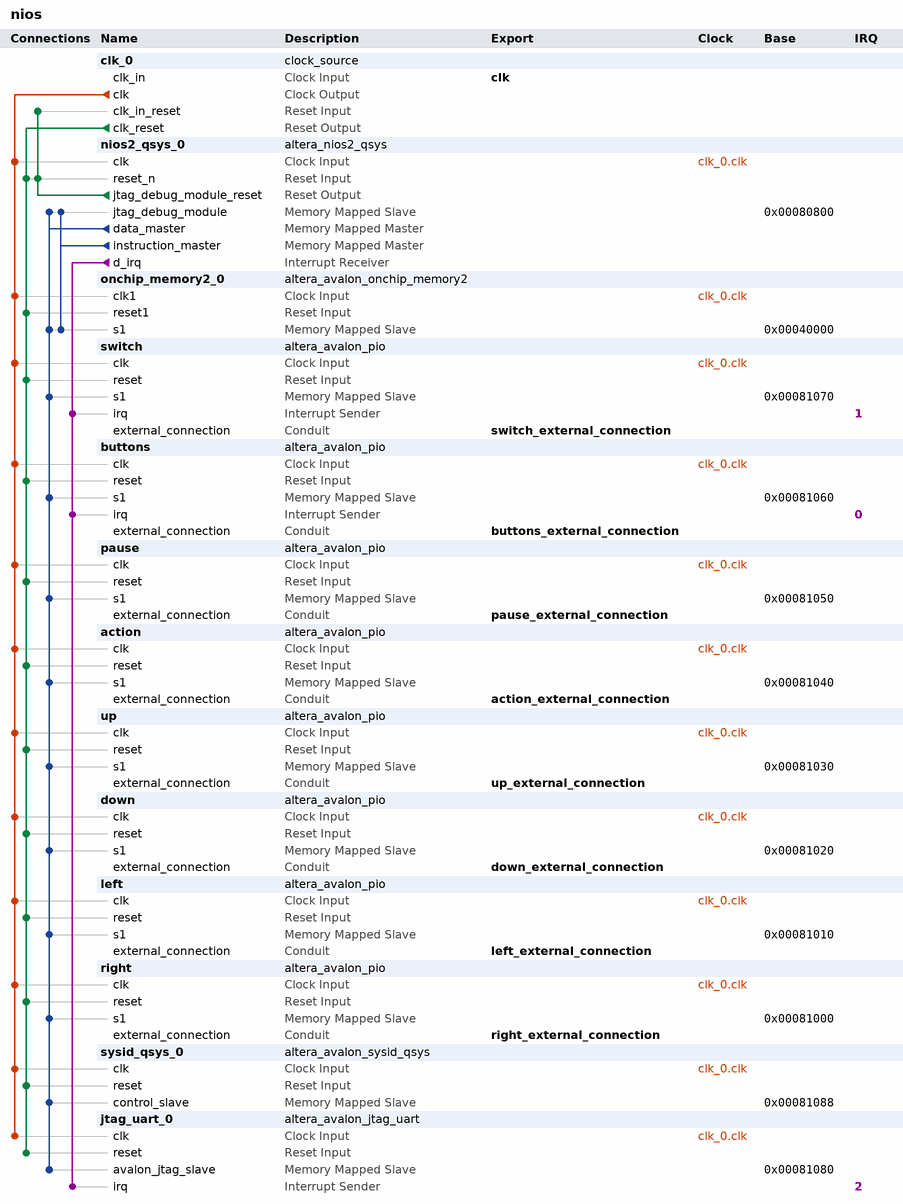
[diagram p0: system contents]
# Platform Designer (Qsys) system nios, Cyclone V 5CGXFC5C6F27C7
# Parameters at their usual value, and those the tool derives, are not listed.
package require -exact qsys 13.0.1
create_system nios
set_project_property DEVICE_FAMILY {Cyclone V}
set_project_property DEVICE 5CGXFC5C6F27C7

add_instance clk_0 clock_source 13.0
set_instance_parameter_value clk_0 clockFrequency 50000000

add_instance nios2_qsys_0 altera_nios2_qsys 13.0
set_instance_parameter_value nios2_qsys_0 resetSlave onchip_memory2_0.s1
set_instance_parameter_value nios2_qsys_0 mmu_TLBMissExcSlave None
set_instance_parameter_value nios2_qsys_0 exceptionSlave onchip_memory2_0.s1
set_instance_parameter_value nios2_qsys_0 breakSlave nios2_qsys_0.jtag_debug_module
set_instance_parameter_value nios2_qsys_0 impl Fast
set_instance_parameter_value nios2_qsys_0 icache_size 4096

add_instance onchip_memory2_0 altera_avalon_onchip_memory2 13.0.1
set_instance_parameter_value onchip_memory2_0 dataWidth 32
set_instance_parameter_value onchip_memory2_0 dualPort false
set_instance_parameter_value onchip_memory2_0 initMemContent true
set_instance_parameter_value onchip_memory2_0 initializationFileName onchip_mem.hex
set_instance_parameter_value onchip_memory2_0 memorySize 262144

add_instance switch altera_avalon_pio 13.0.1
set_instance_parameter_value switch captureEdge true
set_instance_parameter_value switch direction Input
set_instance_parameter_value switch edgeType ANY
set_instance_parameter_value switch generateIRQ true
set_instance_parameter_value switch irqType EDGE
set_instance_parameter_value switch width 2

add_instance buttons altera_avalon_pio 13.0.1
set_instance_parameter_value buttons captureEdge true
set_instance_parameter_value buttons direction Input
set_instance_parameter_value buttons edgeType ANY
set_instance_parameter_value buttons generateIRQ true
set_instance_parameter_value buttons irqType EDGE
set_instance_parameter_value buttons width 4

add_instance pause altera_avalon_pio 13.0.1
set_instance_parameter_value pause direction Output
set_instance_parameter_value pause width 1

add_instance action altera_avalon_pio 13.0.1
set_instance_parameter_value action direction Output
set_instance_parameter_value action width 1

add_instance up altera_avalon_pio 13.0.1
set_instance_parameter_value up direction Output
set_instance_parameter_value up width 1

add_instance down altera_avalon_pio 13.0.1
set_instance_parameter_value down direction Output
set_instance_parameter_value down width 1

add_instance left altera_avalon_pio 13.0.1
set_instance_parameter_value left direction Output
set_instance_parameter_value left width 1

add_instance right altera_avalon_pio 13.0.1
set_instance_parameter_value right direction Output
set_instance_parameter_value right width 1

add_instance sysid_qsys_0 altera_avalon_sysid_qsys 13.0
set_instance_parameter_value sysid_qsys_0 id 4919

add_instance jtag_uart_0 altera_avalon_jtag_uart 13.0.1
set_instance_parameter_value jtag_uart_0 simInteractiveOptions NO_INTERACTIVE_WINDOWS

# connections
add_connection clk_0.clk action.clk clock
add_connection clk_0.clk buttons.clk clock
add_connection clk_0.clk down.clk clock
add_connection clk_0.clk jtag_uart_0.clk clock
add_connection clk_0.clk left.clk clock
add_connection clk_0.clk nios2_qsys_0.clk clock
add_connection clk_0.clk onchip_memory2_0.clk1 clock
add_connection clk_0.clk pause.clk clock
add_connection clk_0.clk right.clk clock
add_connection clk_0.clk switch.clk clock
add_connection clk_0.clk sysid_qsys_0.clk clock
add_connection clk_0.clk up.clk clock
add_connection clk_0.clk_reset action.reset reset
add_connection clk_0.clk_reset buttons.reset reset
add_connection clk_0.clk_reset down.reset reset
add_connection clk_0.clk_reset jtag_uart_0.reset reset
add_connection clk_0.clk_reset left.reset reset
add_connection clk_0.clk_reset nios2_qsys_0.reset_n reset
add_connection clk_0.clk_reset onchip_memory2_0.reset1 reset
add_connection clk_0.clk_reset pause.reset reset
add_connection clk_0.clk_reset right.reset reset
add_connection clk_0.clk_reset switch.reset reset
add_connection clk_0.clk_reset sysid_qsys_0.reset reset
add_connection clk_0.clk_reset up.reset reset
add_connection nios2_qsys_0.jtag_debug_module_reset clk_0.clk_in_reset reset
add_connection nios2_qsys_0.jtag_debug_module_reset nios2_qsys_0.reset_n reset
add_connection nios2_qsys_0.data_master action.s1 avalon
set_connection_parameter_value nios2_qsys_0.data_master/action.s1 baseAddress 0x00081040
add_connection nios2_qsys_0.data_master buttons.s1 avalon
set_connection_parameter_value nios2_qsys_0.data_master/buttons.s1 baseAddress 0x00081060
add_connection nios2_qsys_0.data_master down.s1 avalon
set_connection_parameter_value nios2_qsys_0.data_master/down.s1 baseAddress 0x00081020
add_connection nios2_qsys_0.data_master jtag_uart_0.avalon_jtag_slave avalon
set_connection_parameter_value nios2_qsys_0.data_master/jtag_uart_0.avalon_jtag_slave baseAddress 0x00081080
add_connection nios2_qsys_0.data_master left.s1 avalon
set_connection_parameter_value nios2_qsys_0.data_master/left.s1 baseAddress 0x00081010
add_connection nios2_qsys_0.data_master nios2_qsys_0.jtag_debug_module avalon
set_connection_parameter_value nios2_qsys_0.data_master/nios2_qsys_0.jtag_debug_module baseAddress 0x00080800
add_connection nios2_qsys_0.data_master onchip_memory2_0.s1 avalon
set_connection_parameter_value nios2_qsys_0.data_master/onchip_memory2_0.s1 baseAddress 0x00040000
add_connection nios2_qsys_0.data_master pause.s1 avalon
set_connection_parameter_value nios2_qsys_0.data_master/pause.s1 baseAddress 0x00081050
add_connection nios2_qsys_0.data_master right.s1 avalon
set_connection_parameter_value nios2_qsys_0.data_master/right.s1 baseAddress 0x00081000
add_connection nios2_qsys_0.data_master switch.s1 avalon
set_connection_parameter_value nios2_qsys_0.data_master/switch.s1 baseAddress 0x00081070
add_connection nios2_qsys_0.data_master sysid_qsys_0.control_slave avalon
set_connection_parameter_value nios2_qsys_0.data_master/sysid_qsys_0.control_slave baseAddress 0x00081088
add_connection nios2_qsys_0.data_master up.s1 avalon
set_connection_parameter_value nios2_qsys_0.data_master/up.s1 baseAddress 0x00081030
add_connection nios2_qsys_0.instruction_master nios2_qsys_0.jtag_debug_module avalon
set_connection_parameter_value nios2_qsys_0.instruction_master/nios2_qsys_0.jtag_debug_module baseAddress 0x00080800
add_connection nios2_qsys_0.instruction_master onchip_memory2_0.s1 avalon
set_connection_parameter_value nios2_qsys_0.instruction_master/onchip_memory2_0.s1 baseAddress 0x00040000
add_connection nios2_qsys_0.d_irq buttons.irq interrupt
set_connection_parameter_value nios2_qsys_0.d_irq/buttons.irq irqNumber 0
add_connection nios2_qsys_0.d_irq jtag_uart_0.irq interrupt
set_connection_parameter_value nios2_qsys_0.d_irq/jtag_uart_0.irq irqNumber 2
add_connection nios2_qsys_0.d_irq switch.irq interrupt
set_connection_parameter_value nios2_qsys_0.d_irq/switch.irq irqNumber 1

# exported interfaces
add_interface clk clock sink
set_interface_property clk EXPORT_OF clk_0.clk_in
add_interface switch_external_connection conduit end
set_interface_property switch_external_connection EXPORT_OF switch.external_connection
add_interface buttons_external_connection conduit end
set_interface_property buttons_external_connection EXPORT_OF buttons.external_connection
add_interface pause_external_connection conduit end
set_interface_property pause_external_connection EXPORT_OF pause.external_connection
add_interface action_external_connection conduit end
set_interface_property action_external_connection EXPORT_OF action.external_connection
add_interface up_external_connection conduit end
set_interface_property up_external_connection EXPORT_OF up.external_connection
add_interface down_external_connection conduit end
set_interface_property down_external_connection EXPORT_OF down.external_connection
add_interface left_external_connection conduit end
set_interface_property left_external_connection EXPORT_OF left.external_connection
add_interface right_external_connection conduit end
set_interface_property right_external_connection EXPORT_OF right.external_connection

set_interconnect_requirement {$system} qsys_mm.clockCrossingAdapter HANDSHAKE
set_interconnect_requirement {$system} qsys_mm.maxAdditionalLatency 1

save_system nios.qsys
